# Altium schematic sheet Kasli-SOC_ETH_PHY.SchDoc: Ethernet
size 420 x 297 mm; CheckedBy: G.Kasprowicz; Author: F.Switakowski; CompanyName: WUT ISE; DrawnBy: F.Switakowski; Organization: WUT ISE; Address1: PW ISE; Address2: Nowowiejska 15/19 00-665 Warsaw; Address3: gkasprow@gmail.com; DocumentNumber: 13; Revision: 1; SheetNumber: 13; SheetTotal: 18; ModifiedBy: -; CheckedDate: -; Title2: PHY; DivGrp: WUT ISE; Designer: G.Kasprowicz; ModifiedDate: -; ProjectName: Sensor Box
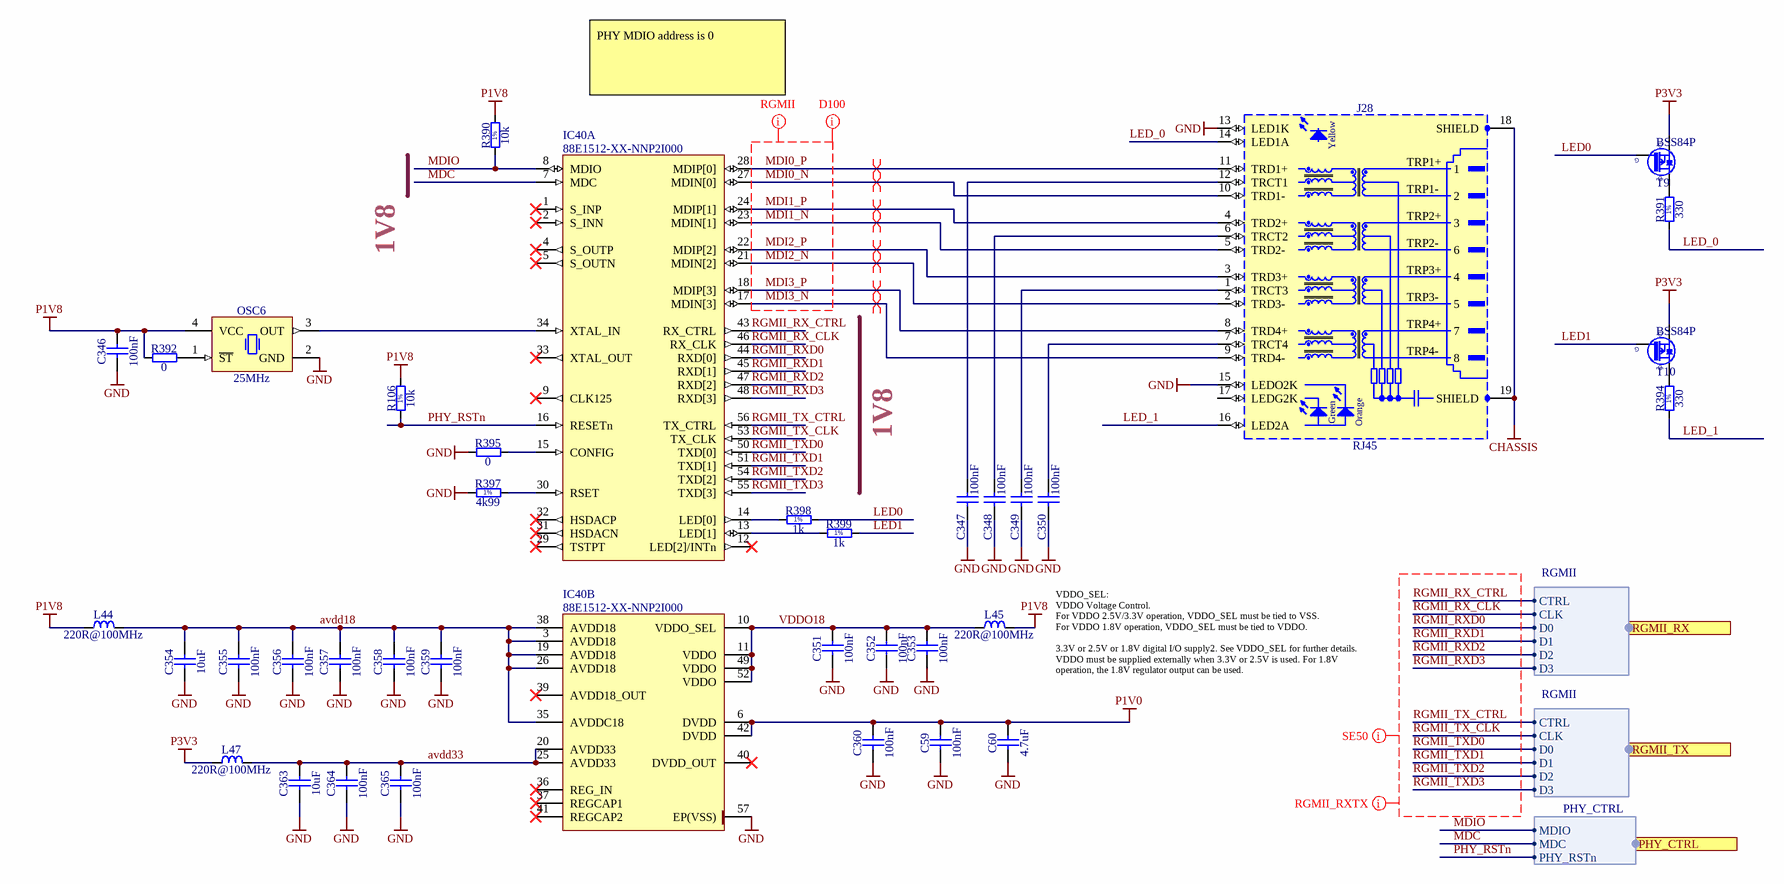
[diagram p0: Kasli-SOC_ETH_PHY.SchDoc]

## Parts
C59  100nF  [CAPC0603X33N]
C60  4.7uF  [CAPC1709X95N]
C346  100nF  [CAPC1005X55N]
C347  100nF  [CAPC1005X55N]
C348  100nF  [CAPC1005X55N]
C349  100nF  [CAPC1005X55N]
C350  100nF  [CAPC1005X55N]
C351  100nF  [CAPC0603X33N]
C352  100nF  [CAPC0603X33N]
C353  100nF  [CAPC0603X33N]
C354  10uF  [CAPC1608X80N]
C355  100nF  [CAPC0603X33N]
C356  100nF  [CAPC0603X33N]
C357  100nF  [CAPC0603X33N]
C358  100nF  [CAPC0603X33N]
C359  100nF  [CAPC0603X33N]
C360  100nF  [CAPC0603X33N]
C363  10uF  [CAPC1608X80N]
C364  100nF  [CAPC0603X33N]
C365  100nF  [CAPC0603X33N]
IC40  88E1512-XX-NNP2I000  [QFN50P800X800X100-57N-S437]  (parts A,B of 2)
J28  RJ45  [BEL_L829-1J1T-43]
L44  220R@100MHz  [INDC2012X105N]
L45  220R@100MHz  [INDC2012X105N]
L47  220R@100MHz  [INDC2012X105N]
OSC6  25MHz  [OSC_MICREL_2520]
R106  10k  [RESC1005X40N]
R390  10k  [RESC1005X40N]
R391  330  [RESC1005X40N]
R392  0  [RESC1005X40N]
R394  330  [RESC1005X40N]
R395  0  [RESC1005X40N]
R397  4k99  [RESC1608X55N]
R398  1k  [RESC1005X40N]
R399  1k  [RESC1005X40N]
T9  BSS84P  [SOT95P240X110-3N]
T10  BSS84P  [SOT95P240X110-3N]

## Ports
PHY_CTRL (harness PHY_CTRL), RGMII_RX (harness RGMII), RGMII_TX (harness RGMII)

## Harnesses
RGMII: CTRL, CLK, D0, D1, D2, D3
PHY_CTRL: MDIO, MDC, PHY_RSTn

## Nets
CHASSIS: J28.18(SHIELD) J28.19(SHIELD)
GND: C59.1 C60.1 C346.1 C347.1 C348.1 C349.1 C350.1 C351.1 C352.1 C353.1 C354.1 C355.1 C356.1 C357.1 C358.1 C359.1 C360.1 C363.1 C364.1 C365.1 IC40.57(EP(VSS)) J28.13(LED1K) J28.15(LEDO2K) OSC6.2(GND) R395.1 R397.1
P1V0: C59.2 C60.2 C360.2 IC40.6(DVDD) IC40.42(DVDD)
P1V8: C346.2 L44.1 L45.2 OSC6.4(VCC) R106.2 R390.2 R392.1
P3V3: L47.1 T9.2(S) T10.2(S)
avdd18: C354.2 C355.2 C356.2 C357.2 C358.2 C359.2 IC40.3(AVDD18) IC40.19(AVDD18) IC40.26(AVDD18) IC40.35(AVDDC18) IC40.38(AVDD18) L44.2
avdd33: C363.2 C364.2 C365.2 IC40.20(AVDD33) IC40.25(AVDD33) L47.2
LED0: R398.2 T9.1(G)
LED1: R399.2 T10.1(G)
LED_0: J28.14(LED1A) R391.1
LED_1: J28.16(LED2A) R394.1
MDC: IC40.7(MDC) ; port PHY_CTRL.MDC
MDI0_N: IC40.27(MDIN[0]) J28.10(TRD1-)
MDI0_P: IC40.28(MDIP[0]) J28.11(TRD1+)
MDI1_N: IC40.23(MDIN[1]) J28.5(TRD2-)
MDI1_P: IC40.24(MDIP[1]) J28.4(TRD2+)
MDI2_N: IC40.21(MDIN[2]) J28.2(TRD3-)
MDI2_P: IC40.22(MDIP[2]) J28.3(TRD3+)
MDI3_N: IC40.17(MDIN[3]) J28.9(TRD4-)
MDI3_P: IC40.18(MDIP[3]) J28.8(TRD4+)
MDIO: IC40.8(MDIO) R390.1 ; port PHY_CTRL.MDIO
PHY_RSTn: IC40.16(RESETn) R106.1 ; port PHY_CTRL.PHY_RSTn
RGMII_RX_CLK: IC40.46(RX_CLK) ; port RGMII_RX.CLK
RGMII_RX_CTRL: IC40.43(RX_CTRL) ; port RGMII_RX.CTRL
RGMII_RXD0: IC40.44(RXD[0]) ; port RGMII_RX.D0
RGMII_RXD1: IC40.45(RXD[1]) ; port RGMII_RX.D1
RGMII_RXD2: IC40.47(RXD[2]) ; port RGMII_RX.D2
RGMII_RXD3: IC40.48(RXD[3]) ; port RGMII_RX.D3
RGMII_TX_CLK: IC40.53(TX_CLK) ; port RGMII_TX.CLK
RGMII_TX_CTRL: IC40.56(TX_CTRL) ; port RGMII_TX.CTRL
RGMII_TXD0: IC40.50(TXD[0]) ; port RGMII_TX.D0
RGMII_TXD1: IC40.51(TXD[1]) ; port RGMII_TX.D1
RGMII_TXD2: IC40.54(TXD[2]) ; port RGMII_TX.D2
RGMII_TXD3: IC40.55(TXD[3]) ; port RGMII_TX.D3
VDDO18: C351.2 C352.2 C353.2 IC40.10(VDDO_SEL) IC40.11(VDDO) IC40.49(VDDO) IC40.52(VDDO) L45.1
NetC347_2: C347.2 J28.12(TRCT1)
NetC348_2: C348.2 J28.6(TRCT2)
NetC349_2: C349.2 J28.1(TRCT3)
NetC350_2: C350.2 J28.7(TRCT4)
NetIC40_13: IC40.13(LED[1]) R399.1
NetIC40_14: IC40.14(LED[0]) R398.1
NetIC40_15: IC40.15(CONFIG) R395.2
NetIC40_30: IC40.30(RSET) R397.2
NetIC40_34: IC40.34(XTAL_IN) OSC6.3(OUT)
NetOSC6_1: OSC6.1(~{ST}) R392.2
NetR391_2: R391.2 T9.3(D)
NetR394_2: R394.2 T10.3(D)

Not connected (* = marked no-connect by the designer): IC40 1(S_INP)* 2(S_INN)* 4(S_OUTP)* 5(S_OUTN)* 9(CLK125)* 12(LED[2]/INTn)* 29(TSTPT)* 31(HSDACN)* 32(HSDACP)* 33(XTAL_OUT)* 36(REG_IN)* 37(REGCAP1)* 39(AVDD18_OUT)* 40(DVDD_OUT)* 41(REGCAP2)*; J28 17(LEDG2K)

## Layout directives
differential pair: MDI0_N, MDI0_P, MDI1_N, MDI1_P, MDI2_N, MDI2_P, MDI3_N, MDI3_P
net class RGMII: MDI0_N, MDI0_P, MDI1_N, MDI1_P, MDI2_N, MDI2_P, MDI3_N, MDI3_P
net class RGMII_RXTX: RGMII_RX_CLK, RGMII_RX_CTRL, RGMII_RXD0, RGMII_RXD1, RGMII_RXD2, RGMII_RXD3, RGMII_TX_CLK, RGMII_TX_CTRL, RGMII_TXD0, RGMII_TXD1, RGMII_TXD2, RGMII_TXD3
net class D100: MDI0_N, MDI0_P, MDI1_N, MDI1_P, MDI2_N, MDI2_P, MDI3_N, MDI3_P
net class SE50: RGMII_RX_CLK, RGMII_RX_CTRL, RGMII_RXD0, RGMII_RXD1, RGMII_RXD2, RGMII_RXD3, RGMII_TX_CLK, RGMII_TX_CTRL, RGMII_TXD0, RGMII_TXD1, RGMII_TXD2, RGMII_TXD3

## Notes on the sheet
- PHY MDIO address is 0
- 1V8
- (near L45) VDDO_SEL:
  VDDO Voltage Control.
  For VDDO 2.5V/3.3V operation, VDDO_SEL must be tied to VSS.
  For VDDO 1.8V operation, VDDO_SEL must be tied to VDDO.
- 3.3V or 2.5V or 1.8V digital I/O supply2. See VDDO_SEL for further details.
  VDDO must be supplied externally when 3.3V or 2.5V is used. For 1.8V
  operation, the 1.8V regulator output can be used.
- Project/Equipment
- Document
- Designer
- Drawn by
- Check.by
- Copyright WUT ISE 2020.
  This documentation describes Open Hardware and is licensed under the CERN OHL v.1.2. You may redistribute and modify this documentation under the terms of the CERN OHL v.1.2. (http://ohwr.org/CERNOHL). This documentation is distributed WITHOUT ANY EXPRESS OR IMPLIED WARRANTY, INCLUDING OF MERCHANTABILITY, SATISFACTORY QUALITY AND FITNESS FOR A PARTICULAR PURPOSE. Please see the CERN OHL v.1.2 for applicable conditions.
- Contact
- File
- Last Mod.
- Print Date
- Sheet
- Size
- A3
- of
- Rev
- (in symbol BELFUSE_L829-1J1T-43) Yellow; TRP1+; TRP1-; TRP2+; TRP2-; TRP3+; TRP3-; TRP4+; TRP4-; Green; Orange
- (in symbol R0402_1K_1%_0.0625W_100PPM) 1%
- (in symbol R0402_10K_1%_0.0625W_100PPM) 1%
- (in symbol R0402_330R_1%_0.0625W_100PPM) 1%
- (in symbol R0603_4K99_1%_0.063W_50PPM) 1%

## Library data of the parts
C59 C351-C353 C355-C360 C364 C365 = CC0201_100NF_6.3V_10%_X5R: Non-polarised capacitor; Part Description: SMD Multilayer Chip Ceramic Capacitor; Manufacturer: GENERIC; Manufacturer1 Part Number: 02016D104KAT2A; Voltage: 6.3V; TC: X5R; Tolerance: ±10%; Part Number: CC0201_100NF_6.3V_10%_X5R; Component Kind: Standard; Component Type: Standard; Pin Count: 2; Value: 100nF; Status: Not Recommended; Manufacturer Part Number: CC0201_100NF_6.3V_10%_X5R; Case: 0201; Mounted: Yes; Socket: No; SMD: Yes; Sense: No; Manufacturer1 Example: AVX; Manufacturer1 ComponentHeight: 0.33mm; HelpURL: \\cern.ch\dfs\Applications\Altium\Datasheets\CC0201_X5R_AVX.pdf; Author: CERN DEM JLC; CreateDate: 03.12.2007; LatestRevisionDate: 03.12.2007
C60 = CC0603_4.7UF_16V_10%_X5R: Non-polarised capacitor; Part Description: SMD Multilayer Chip Ceramic Capacitor; Manufacturer: GENERIC; Manufacturer1 Part Number: EMK107ABJ475KA-T; Voltage: 16V; TC: X5R; Tolerance: ±10%; Part Number: CC0603_4.7UF_16V_10%_X5R; Component Kind: Standard; Component Type: Standard; Pin Count: 2; Value: 4.7uF; Status: None; Manufacturer Part Number: CC0603_4.7UF_16V_10%_X5R; Case: 0603; Mounted: Yes; Socket: No; SMD: Yes; Sense: No; Manufacturer1 Example: TAIYO YUDEN; Manufacturer1 ComponentHeight: 0.95mm; HelpURL: \\cern.ch\dfs\Applications\Altium\Datasheets\CC0603_X7R_TAIYO-YUDEN_HIGH-VALUE.pdf; Author: CERN DEM JLC; CreateDate: 16.12.2013; LatestRevisionDate: 16.09.2014
C346-C350 = CC0402_100NF_16V_10%_X7R: Non-polarised capacitor; Part Description: SMD Multilayer Chip Ceramic Capacitor; Manufacturer: GENERIC; Manufacturer1 Part Number: GRM155R71C104KA88D; Voltage: 16V; TC: X7R; Tolerance: ±10%; Part Number: CC0402_100NF_16V_10%_X7R; Component Kind: Standard; Component Type: Standard; Pin Count: 2; Value: 100nF; Status: Not Recommended; Manufacturer Part Number: CC0402_100NF_16V_10%_X7R; Case: 0402; Mounted: Yes; Socket: No; SMD: Yes; Sense: No; Manufacturer1 Example: MURATA; Manufacturer1 ComponentHeight: 0.55mm; HelpURL: \\cern.ch\dfs\Applications\Altium\Datasheets\CC0402_X7R_MURATA_GRM.pdf; Author: CERN DEM JLC; CreateDate: 05/12/2013; LatestRevisionDate: 03/12/2007
C354 C363 = CC0603_10UF_16V_20%_X5R: Non-polarised capacitor; Part Description: SMD Multilayer Chip Ceramic Capacitor; Manufacturer: GENERIC; Manufacturer1 Part Number: GRM188R61C106MA73D; Voltage: 16V; TC: X5R; Tolerance: ±20%; Part Number: CC0603_10UF_16V_20%_X5R; Component Kind: Standard; Component Type: Standard; Pin Count: 2; Value: 10uF; Status: None; Manufacturer Part Number: CC0603_10UF_16V_20%_X5R; Case: 0603; Mounted: Yes; Socket: No; SMD: Yes; Sense: No; Manufacturer1 Example: MURATA; Manufacturer1 ComponentHeight: 0.8mm; HelpURL: \\cern.ch\dfs\Applications\Altium\Datasheets\CC0603_X5R_MURATA_GRM.pdf; Author: CERN DEM MR; CreateDate: 02.03.2016; LatestRevisionDate: 02.03.2016
IC40 = 88E1512-XX-NNP2I000: Alaska Integrated 10/100/1000 Mbps Energy Efficient Ethernet Transceiver; Manufacturer: MARVELL  TECHNOLOGY; PressFit: No; Bonding: No; Part Number: 88E1512-XX-NNP2I000; Component Kind: Standard; Component Type: Standard; Device: 88E1512-XX-NNP2I000; PackageDescription: QFN, 0.50mm Pitch, Square; 56 Pin, 8.00mm L X 8.00mm W X 1.00mm H Body (4.37mm X 4.37mm Thermal Tab), IPC Medium Density; Part Description: Alaska Integrated 10/100/1000 Mbps Energy Efficient Ethernet Transceiver; Manufacturer Part Number: 88E1512-XX-NNP2I000; Pin Count: 57; Case: QFN56; Mounted: Yes; Socket: No; SMD: Yes; Sense: No; ComponentHeight: 1mm; Author: CERN DEM JLC; HelpURL: \\cern.ch\dfs\Applications\Altium\Datasheets\88E1512-XX-NNP2I000.pdf; CreateDate: 21.01.2015; LatestRevisionDate: 21.01.2015
J28 = BELFUSE_L829-1J1T-43: 1 Port, RJ45, Gigabit Ethernet, MagJack Connector Module With Yellow And Green/Orange LEDs; Part Description: 1 Port, Yellow/ Green-Orange LEDs,  RJ45 10/100/1000 Gigabit Ethernet, MagJack® Connector Module; Manufacturer: BEL MAGNETIC SOLUTIONS; PressFit: No; Part Number: BELFUSE_L829-1J1T-43; Component Kind: Standard; Component Type: Standard; Pin Count: 19; Family: RJ45; Mounted: Yes; Socket: No; SMD: No; Sense: No; Status: None; Manufacturer Part Number: L829-1J1T-43; ComponentHeight: 13.3mm; HelpURL: \\cern.ch\dfs\Applications\Altium\Datasheets\BEL_L829-1J1T-43.pdf; Author: CERN DEM JLC; CreateDate: 22.08.2011; LatestRevisionDate: 20.09.2018
L44 L45 L47 = IND0805_MURATA_BLM21PG221SN1D: Inductor; Part Description: SMD EMIFIL Suppression Chip Ferrite Bead; Manufacturer: MURATA; Power: 2A; Resistance: 0.05R; Tolerance: ±25%; Part Number: IND0805_MURATA_BLM21PG221SN1D; Component Kind: Standard; Component Type: Standard; Pin Count: 2; Value: 220R@100MHz; Status: None; Manufacturer Part Number: BLM21PG221SN1D; Case: 0805; Mounted: Yes; Socket: No; SMD: Yes; Sense: No; ComponentHeight: 1.05mm; HelpURL: \\cern.ch\dfs\Applications\Altium\Datasheets\IND0805_MURATA_BLM21P.pdf; Author: CERN DEM JLC; CreateDate: 25/01/2010; LatestRevisionDate: 25/01/2010
OSC6 = OSC_25MHZ_MICREL_DSC1001DI5-025.0000T: Oscillator 4 pins 1=\ST 2=GND 3=OUT 4=VCC; Part Description: 1.8V-3.3V, ±10ppm, 15pF,-40..85°C, HCMOS/TTL Surface Mount Low-Power Precision CMOS Oscillator (DSC1001 Series); Manufacturer: MICREL; PressFit: No; Bonding: No; Part Number: OSC_25MHZ_MICREL_DSC1001DI5-025.0000T; Component Kind: Standard; Component Type: Standard; PackageDescription: MICREL SMD Oscillator, QFN, 4 pins, 2.5mm x 2.0mm; Value: 25MHz; Manufacturer Part Number: DSC1001DI5-025.0000T; Pin Count: 4; Mounted: Yes; Socket: No; SMD: Yes; Sense: No; ComponentHeight: 0.9mm; HelpURL: \\cern.ch\dfs\Applications\Altium\Datasheets\OSC_MICREL_DSC1001.pdf; Author: CERN DEM JLC; CreateDate: 22.01.2015; LatestRevisionDate: 01.04.2015
R106 R390 = R0402_10K_1%_0.0625W_100PPM: Resistor - 1%; Part Description: General Purpose Thick Film Chip Resistor; Manufacturer: GENERIC; Manufacturer1 Part Number: 232270671003L; TC: ±100ppm/°C; PressFit: No; Part Number: R0402_10K_1%_0.0625W_100PPM; Component Kind: Standard; Component Type: Standard; Pin Count: 2; Value: 10k; Status: Not Recommended; Power: 0.0625W; Tolerance: ±1%; Manufacturer Part Number: R0402_10K_1%_0.0625W_100PPM; Case: 0402; Mounted: Yes; Sense: No; Socket: No; SMD: Yes; Manufacturer1 Example: YAGEO PHYCOMP; Manufacturer1 ComponentHeight: 0.4mm; HelpURL: \\cern.ch\dfs\Applications\Altium\Datasheets\R0402_Phycomp_RC0402.pdf; Author: CERN DEM JLC; CreateDate: 03.12.2007; LatestRevisionDate: 17.10.2012
R391 R394 = R0402_330R_1%_0.0625W_100PPM: Resistor - 1%; Part Description: General Purpose Thick Film Chip Resistor; Manufacturer: GENERIC; Manufacturer1 Part Number: 232270673301L; TC: ±100ppm/°C; PressFit: No; Part Number: R0402_330R_1%_0.0625W_100PPM; Component Kind: Standard; Component Type: Standard; Pin Count: 2; Value: 330; Status: Not Recommended; Power: 0.0625W; Tolerance: ±1%; Manufacturer Part Number: R0402_330R_1%_0.0625W_100PPM; Case: 0402; Mounted: Yes; Sense: No; Socket: No; SMD: Yes; Manufacturer1 Example: YAGEO PHYCOMP; Manufacturer1 ComponentHeight: 0.4mm; HelpURL: \\cern.ch\dfs\Applications\Altium\Datasheets\R0402_Phycomp_RC0402.pdf; Author: CERN DEM JLC; CreateDate: 03.12.2007; LatestRevisionDate: 17.10.2012
R392 R395 = R0402_0R_JUMPER: Resistor; Part Description: 1A (0.05R Max DC Resistance) Zero Ohm Jumper; Manufacturer: GENERIC; Manufacturer1 Part Number: 232270591001L; PressFit: No; Part Number: R0402_0R_JUMPER; Component Kind: Standard; Component Type: Standard; Pin Count: 2; Value: 0; Status: Not Recommended; Manufacturer Part Number: R0402_0R_JUMPER; Case: 0402; Mounted: Yes; Sense: No; Socket: No; SMD: Yes; Manufacturer1 Example: YAGEO PHYCOMP; Manufacturer1 ComponentHeight: 0.4mm; HelpURL: \\cern.ch\dfs\Applications\Altium\Datasheets\R0402_Phycomp_RC0402.pdf; Author: CERN DEM JLC; CreateDate: 03.12.2007; LatestRevisionDate: 17.10.2012
R397 = R0603_4K99_1%_0.063W_50PPM: Resistor - 1%; Part Description: General Purpose Thick Film Chip Resistor; Manufacturer: GENERIC; Manufacturer1 Part Number: CPF0603F4K99C1; Power: 0.063W; TC: ±50ppm/°C; PressFit: No; Part Number: R0603_4K99_1%_0.063W_50PPM; Component Kind: Standard; Component Type: Standard; Pin Count: 2; Value: 4k99; Status: None; Tolerance: ±1%; Manufacturer Part Number: R0603_4K99_1%_0.063W_50PPM; Case: 0603; Mounted: Yes; Sense: No; Socket: No; SMD: Yes; Manufacturer1 Example: TYCO NEOHM; Manufacturer1 ComponentHeight: 0.55mm; HelpURL: \\cern.ch\dfs\Applications\Altium\Datasheets\R0603_TYCO_CPF.pdf; Author: CERN DEM JLC; CreateDate: 20.05.2010; LatestRevisionDate: 20.05.2010
R398 R399 = R0402_1K_1%_0.0625W_100PPM: Resistor - 1%; Part Description: General Purpose Thick Film Chip Resistor; Manufacturer: GENERIC; Manufacturer1 Part Number: 232270671002L; TC: ±100ppm/°C; PressFit: No; Part Number: R0402_1K_1%_0.0625W_100PPM; Component Kind: Standard; Component Type: Standard; Pin Count: 2; Value: 1k; Status: Not Recommended; Power: 0.0625W; Tolerance: ±1%; Manufacturer Part Number: R0402_1K_1%_0.0625W_100PPM; Case: 0402; Mounted: Yes; Sense: No; Socket: No; SMD: Yes; Manufacturer1 Example: YAGEO PHYCOMP; Manufacturer1 ComponentHeight: 0.4mm; HelpURL: \\cern.ch\dfs\Applications\Altium\Datasheets\R0402_Phycomp_RC0402.pdf; Author: CERN DEM JLC; CreateDate: 03.12.2007; LatestRevisionDate: 17.10.2012
T9 T10 = BSS84P: P-CHANNEL MOSFET WITH DIODE; Part Description: -60V -170mA P-Channel SIPMOS Small-Signal Transistor; Manufacturer: INFINEON; PressFit: No; Bonding: No; Part Number: BSS84P; Component Kind: Standard; Component Type: Standard; Device: BSS84P; PackageDescription: SOT23 3-Leads, Pitch 0.95mm - Body 1.4x3mm, IPC Medium Density; Manufacturer Part Number: BSS84P; Pin Count: 3; Case: SOT23-3; Mounted: Yes; Socket: No; SMD: Yes; Sense: No; ComponentHeight: 1.1mm; HelpURL: \\cern.ch\dfs\Applications\Altium\Datasheets\BSS84P.pdf; Author: CERN DEM JLC; CreateDate: 11/07/2018; LatestRevisionDate: 11/07/2018